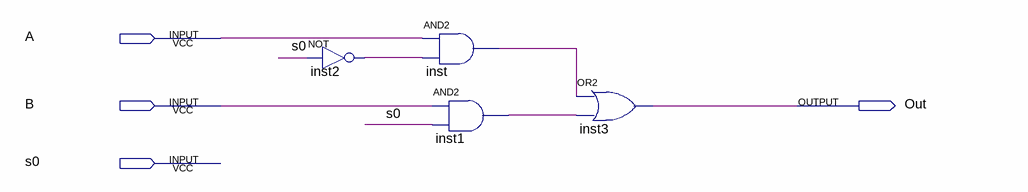
[diagram p0: schematic sheet]
// Quartus schematic mux_2p1_1bit.bdf as structural Verilog: 4 symbols, 4 pins
module mux_2p1_1bit (
  input  A,
  input  B,
  input  s0,
  output Out
);

  wire inst1_out, inst2_out, inst_out;

  not inst2 (inst2_out, s0);
  and inst (inst_out, A, inst2_out);
  and inst1 (inst1_out, B, s0);
  or inst3 (Out, inst_out, inst1_out);
endmodule
